# EAGLE design JBC_Station_V3 (EAGLE 7.7.0)
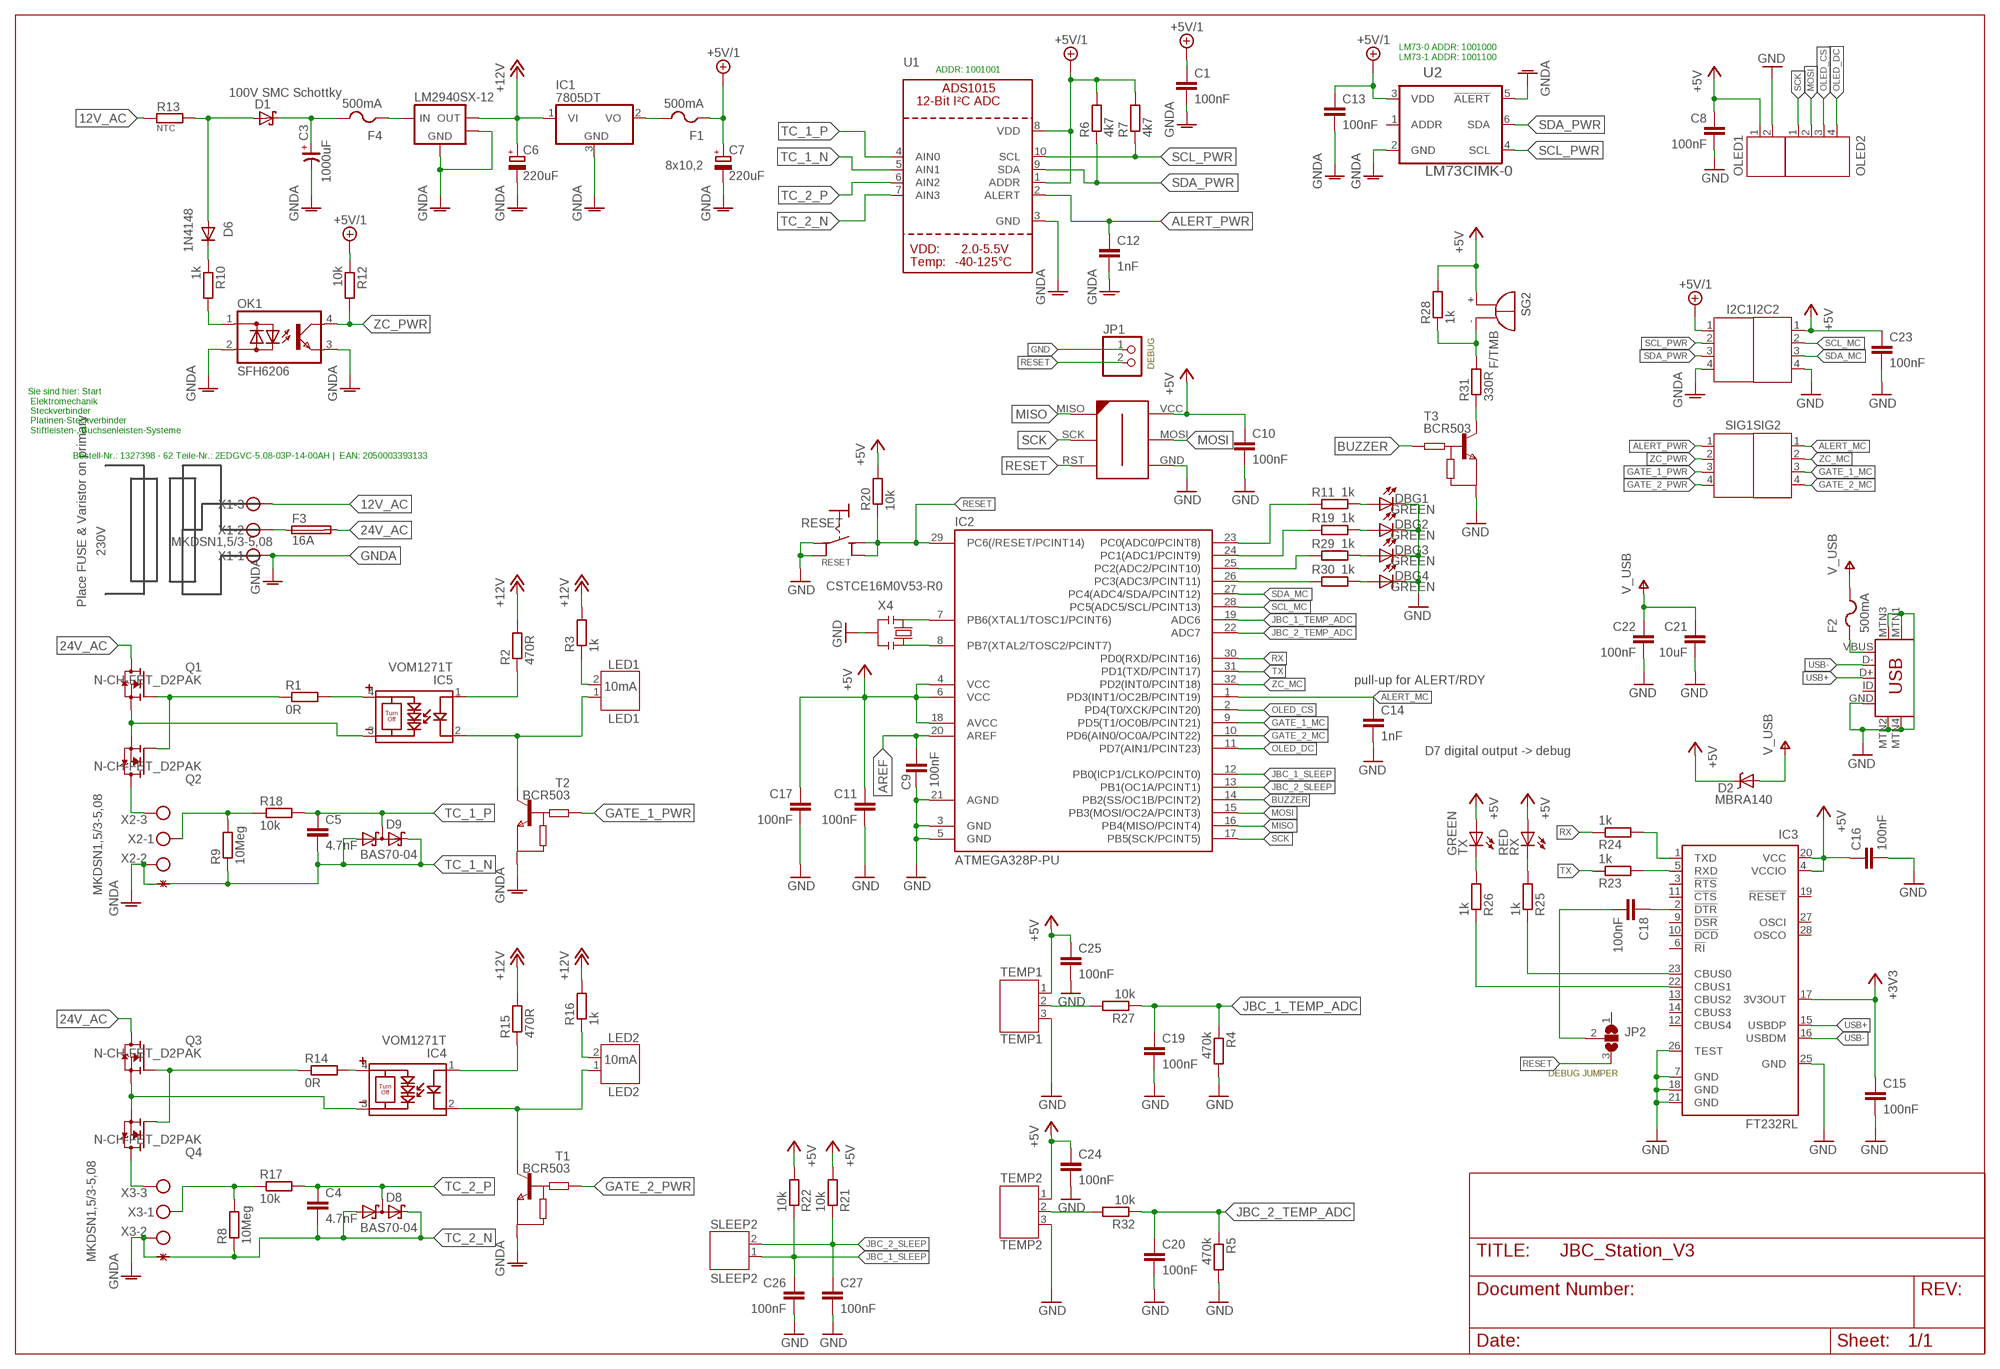
[diagram p0: schematic, sheet 1]

## Parts
C1  100nF  C-EUC0805  [C0805]
C3  1000uF  CP_SV-H  [CSV-H]
C4  4.7nF  C-EUC0805  [C0805]
C5  4.7nF  C-EUC0805  [C0805]
C6  220uF  CPOL-EUE  [PANASONIC_E]
C7  220uF  CPOL-EUE  [PANASONIC_E]
C8  100nF  C-EUC0805  [C0805]
C9  100nF  C-EUC0805  [C0805]
C10  100nF  C-EUC0805  [C0805]
C11  100nF  C-EUC0805  [C0805]
C12  1nF  C-EUC0805  [C0805]
C13  100nF  C-EUC0805  [C0805]
C14  1nF  C-EUC0805  [C0805]
C15  100nF  C-EUC0805  [C0805]
C16  100nF  C-EUC0805  [C0805]
C17  100nF  C-EUC0805  [C0805]
C18  100nF  C-EUC0805  [C0805]
C19  100nF  C-EUC0805  [C0805]
C20  100nF  C-EUC0805  [C0805]
C21  10uF  C-EUC1210  [C1210]
C22  100nF  C-EUC0805  [C0805]
C23  100nF  C-EUC0805  [C0805]
C24  100nF  C-EUC0805  [C0805]
C25  100nF  C-EUC0805  [C0805]
C26  100nF  C-EUC0805  [C0805]
C27  100nF  C-EUC0805  [C0805]
D1  100V SMC Schottky  SCHOTTKY-DIODESMC  [SMC]
D2  MBRA140  DIODE-SCHOTTKY_  [SMA-DIODE]
D6  1N4148  DIODE-MINIMELF  [MINIMELF]
D8  BAS70-04  [SOT23]
D9  BAS70-04  [SOT23]
DBG1  GREEN  LEDCHIP-LED0603  [CHIP-LED0603]
DBG2  GREEN  LEDCHIP-LED0603  [CHIP-LED0603]
DBG3  GREEN  LEDCHIP-LED0603  [CHIP-LED0603]
DBG4  GREEN  LEDCHIP-LED0603  [CHIP-LED0603]
F1  500mA  PTCFUSE-1206  [R1206]
F2  500mA  PTCFUSE-1206  [R1206]
F3  16A  SH25  [SH25]
F4  500mA  PTCFUSE-1206  [R1206]
I2C1  JST-PH4  [JST-PH4]
I2C2  JST-PH4  [JST-PH4]
IC1  7805DT  [TO252]
IC2  ATMEGA328P-PU  MEGA48/88/168-AU  [TQFP32-08]
IC3  FT232RL  [SSOP28]
IC4  VOM1271T  [SOP-4]
IC5  VOM1271T  [SOP-4]
JP1  PINHD-1X2_2.54  [1X02]
JP2  SJ2W  [SJ_2]
LED1  LED1  JST-PH2  [JST-PH2]
LED2  LED2  JST-PH2  [JST-PH2]
LM2940SX-12  LM2940KTT  [TO263-3]
OK1  SFH6206  [DIL4-SMD]
OLED1  JST-PH2  [JST-PH2]
OLED2  JST-PH4  [JST-PH4]
Q1  N-CH-FET_D2PAK  [D2PACK]
Q2  N-CH-FET_D2PAK  [D2PACK]
Q3  N-CH-FET_D2PAK  [D2PACK]
Q4  N-CH-FET_D2PAK  [D2PACK]
R1  0R  R-EU_R0805  [R0805]
R2  470R  R-EU_R0805  [R0805]
R3  1k  R-EU_R0805  [R0805]
R4  470k  R-EU_R0805  [R0805]
R5  470k  R-EU_R0805  [R0805]
R6  4k7  R-EU_R0805  [R0805]
R7  4k7  R-EU_R0805  [R0805]
R8  10Meg  R-EU_R0805  [R0805]
R9  10Meg  R-EU_R0805  [R0805]
R10  1k  R-EU_R0805  [R0805]
R11  1k  R-EU_R0805  [R0805]
R12  10k  R-EU_R0805  [R0805]
R13  NTC  SQMR7  [SQM-VERTICAL-7W]
R14  0R  R-EU_R0805  [R0805]
R15  470R  R-EU_R0805  [R0805]
R16  1k  R-EU_R0805  [R0805]
R17  10k  R-EU_R0805  [R0805]
R18  10k  R-EU_R0805  [R0805]
R19  1k  R-EU_R0805  [R0805]
R20  10k  R-EU_R0805  [R0805]
R21  10k  R-EU_R0805  [R0805]
R22  10k  R-EU_R0805  [R0805]
R23  1k  R-EU_R0805  [R0805]
R24  1k  R-EU_R0805  [R0805]
R25  1k  R-EU_R0805  [R0805]
R26  1k  R-EU_R0805  [R0805]
R27  10k  R-EU_R0805  [R0805]
R28  1k  R-EU_R0805  [R0805]
R29  1k  R-EU_R0805  [R0805]
R30  1k  R-EU_R0805  [R0805]
R31  330R  R-EU_R0805  [R0805]
R32  10k  R-EU_R0805  [R0805]
RESET  RESET  TASTE_DRST_TA1  [TASTE_DRST_TA1]
RX  RED  LEDCHIP-LED0603  [CHIP-LED0603]
SG2  F/TMB  [F/TMB]
SIG1  JST-PH4  [JST-PH4]
SIG2  JST-PH4  [JST-PH4]
SLEEP2  SLEEP2  JST-PH2  [JST-PH2]
T1  BCR503  GM4_BIP_NPN-DIG_SOT23_RZ  [GM4_BIP_SOT23_RZ]
T2  BCR503  GM4_BIP_NPN-DIG_SOT23_RZ  [GM4_BIP_SOT23_RZ]
T3  BCR503  GM4_BIP_NPN-DIG_SOT23_RZ  [GM4_BIP_SOT23_RZ]
TEMP1  TEMP1  JST-PH3  [JST-PH3]
TEMP2  TEMP2  JST-PH3  [JST-PH3]
TX  GREEN  LEDCHIP-LED0603  [CHIP-LED0603]
U1  ADC_ADS1015  [MSOP10]
U2  LM73CIMK-0  [SOT95P285X100-6N]
U$2  STARPONT  [STARPOINT]
U$3  STARPONT  [STARPOINT]
U$5  AVR-ISP-6-EDGE  [6PAD_ISP]
USB  USB-MINIB-5PIN  [USB-MINIB]
X1  MKDSN1,5/3-5,08  [MKDSN1,5/3-5,08]
X2  MKDSN1,5/3-5,08  [MKDSN1,5/3-5,08]
X3  MKDSN1,5/3-5,08  [MKDSN1,5/3-5,08]
X4  CSTCE16M0V53-R0  0011_CSTCE16M0V53-R0  [RESONATOR]

## Nets
12V_AC: R13.P$1 X1.3
12V_AC_PROT: D1.A D6.A R13.P$2
24V_AC: F3.2 Q1.2(D) Q3.2(D)
+3V3: C15.1 IC3.17(3V3OUT)
+5V: C8.1 C10.1 C11.1 C16.1 C17.1 C23.1 C24.1 C25.1 D2.C I2C2.1 IC2.4(VCC) IC2.6(VCC) IC2.18(AVCC) IC3.4(VCCIO) IC3.20(VCC) OLED1.1 R20.2 R21.2 R22.2 R28.2 RX.A SG2.+ TEMP1.1 TEMP2.1 TX.A U$5.VCC
+5V/1: C1.1 C7.+ C13.1 F1.1 I2C1.1 R6.2 R7.2 R12.1 U1.1(ADDR) U1.8(VDD) U2.3(VDD)
+12V: C6.+ IC1.1(VI) LM2940SX-12.3(VOUT) R2.2 R3.2 R15.2 R16.2
ALERT_MC: C14.1 IC2.1(PD3(INT1/OC2B/PCINT19)) SIG2.1
ALERT_PWR: C12.1 SIG1.1 U1.2(ALERT)
AREF: C9.1 IC2.20(AREF)
BUZZER: IC2.14(PB2(SS/OC1B/PCINT2)) T3.1(B)
DBG1: IC2.23(PC0(ADC0/PCINT8)) R11.2
DBG2: IC2.24(PC1(ADC1/PCINT9)) R19.2
DBG3: IC2.25(PC2(ADC2/PCINT10)) R29.2
DBG4: IC2.26(PC3(ADC3/PCINT11)) R30.2
GATE_1_MC: IC2.9(PD5(T1/OC0B/PCINT21)) SIG2.3
GATE_1_PWR: SIG1.3 T2.1(B)
GATE_2_MC: IC2.10(PD6(AIN0/OC0A/PCINT22)) SIG2.4
GATE_2_PWR: SIG1.4 T1.1(B)
GND: C8.2 C9.2 C10.2 C11.2 C14.2 C15.2 C16.2 C17.2 C19.2 C20.2 C21.2 C22.2 C23.2 C24.2 C25.2 C26.2 C27.2 DBG1.C DBG2.C DBG3.C DBG4.C I2C2.4 IC2.3(GND) IC2.5(GND) IC2.21(AGND) IC3.7(GND) IC3.18(GND) IC3.21(GND) IC3.25(GND) IC3.26(TEST) JP1.1 OLED1.2 R4.2 R5.2 RESET.P$1 RESET.P$2 T3.2(E) TEMP1.3 TEMP2.3 U$5.GND USB.GND USB.MTN1(MTN2) USB.MTN2(MTN3) USB.MTN3(MTN1) USB.MTN4 X4.2
GNDA: C1.2 C3.- C6.- C7.- C12.2 C13.2 I2C1.4 IC1.3(GND) LM2940SX-12.2(GND) LM2940SX-12.TAB OK1.2(AC2) OK1.3(E) T1.2(E) T2.2(E) U1.3(GND) U2.2(GND) U2.5(!ALERT!) U$2.P$2 U$3.P$2 X1.1 X2.2 X3.2
JBC_1_SLEEP: C26.1 IC2.12(PB0(ICP1/CLKO/PCINT0)) R22.1 SLEEP2.1
JBC_1_TEMP_ADC: C19.1 IC2.19(ADC6) R4.1 R27.1
JBC_2_SLEEP: C27.1 IC2.13(PB1(OC1A/PCINT1)) R21.1 SLEEP2.2
JBC_2_TEMP_ADC: C20.1 IC2.22(ADC7) R5.1 R32.1
MISO: IC2.16(PB4(MISO/PCINT4)) U$5.MISO
MOSI: IC2.15(PB3(MOSI/OC2A/PCINT3)) OLED2.2 U$5.MOSI
N$1: IC5.4 R1.2
N$2: Q1.1(G) Q2.1(G) R1.1
N$3: LED1.2 R3.1
N$4: IC5.2 LED1.1 T2.3(C)
N$5: IC5.1 R2.1
N$6: IC2.7(PB6(XTAL1/TOSC1/PCINT6)) X4.1
N$7: Q3.1(G) Q4.1(G) R14.1
N$8: Q2.2(D) X2.3
N$9: OK1.1(AC1) R10.2
N$10: Q4.2(D) X3.3
N$11: R9.2 R18.1 X2.1
N$12: C3.+ D1.C F4.2
N$13: R8.2 R17.1 X3.1
N$14: IC5.3 Q1.3(S) Q2.3(S)
N$15: IC4.3 Q3.3(S) Q4.3(S)
N$16: IC4.4 R14.2
N$17: IC4.2 LED2.1 T1.3(C)
N$18: IC4.1 R15.1
N$19: IC2.8(PB7(XTAL2/TOSC2/PCINT7)) X4.3
N$20: LED2.2 R16.1
N$21: F3.1 X1.2
N$23: D6.C R10.1
N$24: C18.2 JP2.2
N$25: C18.1 IC3.2(!DTR)
N$26: F1.2 IC1.2(VO)
N$27: IC3.1(TXD) R24.2
N$28: IC3.5(RXD) R23.2
N$29: IC3.23(CBUS0) R25.1
N$30: IC3.22(CBUS1) R26.1
N$31: R25.2 RX.C
N$32: F2.1 USB.VBUS
N$33: R26.2 TX.C
N$35: R27.2 TEMP1.2
N$37: R28.1 R31.2 SG2.-
N$38: DBG1.A R11.1
N$39: F4.1 LM2940SX-12.1(VIN)
N$40: DBG2.A R19.1
N$41: DBG3.A R29.1
N$42: DBG4.A R30.1
N$46: R31.1 T3.3(C)
N$47: R32.2 TEMP2.2
OLED_CS: IC2.2(PD4(T0/XCK/PCINT20)) OLED2.3
OLED_DC: IC2.11(PD7(AIN1/PCINT23)) OLED2.4
RESET: IC2.29(PC6(/RESET/PCINT14)) JP1.2 JP2.3 R20.1 RESET.P$3 RESET.P$4 U$5.RST
RX: IC2.30(PD0(RXD/PCINT16)) R24.1
SCK: IC2.17(PB5(SCK/PCINT5)) OLED2.1 U$5.SCK
SCL_MC: I2C2.2 IC2.28(PC5(ADC5/SCL/PCINT13))
SCL_PWR: I2C1.2 R7.1 U1.10(SCL) U2.4(SCL)
SDA_MC: I2C2.3 IC2.27(PC4(ADC4/SDA/PCINT12))
SDA_PWR: I2C1.3 R6.1 U1.9(SDA) U2.6(SDA)
TC_1_N: C5.2 D9.1(A1) D9.2(C2) R9.1 U1.5(AIN1) U$2.P$1
TC_1_P: C5.1 D9.3(C1A2) R18.2 U1.4(AIN0)
TC_2_N: C4.2 D8.1(A1) D8.2(C2) R8.1 U1.7(AIN3) U$3.P$1
TC_2_P: C4.1 D8.3(C1A2) R17.2 U1.6(AIN2)
TX: IC2.31(PD1(TXD/PCINT17)) R23.1
USB+: IC3.15(USBDP) USB.D+
USB-: IC3.16(USBDM) USB.D-
V+: C21.1 C22.1 D2.A F2.2 ; supply symbol labelled V_USB
ZC_MC: IC2.32(PD2(INT0/PCINT18)) SIG2.2
ZC_PWR: OK1.4(C) R12.2 SIG1.2
Unconnected: IC3.3(!RTS) IC3.6(!RI) IC3.9(!DSR) IC3.10(!DCD) IC3.11(!CTS) IC3.12(CBUS4) IC3.13(CBUS2) IC3.14(CBUS3) IC3.19(!RESET) IC3.27(OSCI) IC3.28(OSCO) JP2.1 U2.1(ADDR) USB.ID

## Notes on the sheet
- LM73-0 ADDR: 1001000
  LM73-1 ADDR: 1001100
- ADDR: 1001001
- 8x10,2
- DEBUG
- Sie sind hier: Start 
   Elektromechanik 
   Steckverbinder 
   Platinen-Steckverbinder 
   Stiftleisten-, Buchsenleisten-Systeme
- Bestell-Nr.: 1327398 - 62 Teile-Nr.: 2EDGVC-5.08-03P-14-00AH |  EAN: 2050003393133
- 230V
- Place FUSE & Varistor on primary
- pull-up for ALERT/RDY
- 10mA
- D7 digital output -> debug
- 10mA
- DEBUG JUMPER

## Library data of the parts
C1 C4 C5 C8-C27 = rcl:C-EU: CAPACITOR, European symbol
C3 = rc-master-smd:CP_: POLARIZED CAP
C6 C7 = rcl:CPOL-EU: POLARIZED CAPACITOR, European symbol
D1 = diode:SCHOTTKY-DIODE: Schottky Diode
D2 = SparkFun:DIODE-SCHOTTKY
D6 = diode:DIODE-: DIODE
D8 D9 = diode:BAS70-04: Silicon Schottky Diodes General-purpose diode for high-speed switching
DBG1-DBG4 RX TX = led:LED: LED OSRAM: - CHIPLED LG R971, LG N971, LY N971, LG Q971, LY Q971, LO R971, LY R971 LH N974, LH R974 LS Q976, LO Q976, LY Q976 LO Q996 - Hyper CHIPLED LW Q18S LB Q993, LB Q99A, LB R99A - SideLED LS A670, LO A670, LY A670, LG A670, LP A670 LB A673, LV A673, LT A673, LW A673 LH A674 LY A675 LS A676, LA A676, LO A676, LY A676, LW A676 LS A679, LY A679, LG A679 - Hyper Micro SIDELED® LS Y876, LA Y876, LO Y876, LY Y876 LT Y87S - SmartLED LW L88C, LW L88S LB L89C, LB L89S, LG L890 LS L89K, LO L89K, LY L89K LS L896, LA L896, LO L896, LY L896 - TOPLED LS T670, LO T670, LY T670, LG T670, LP T670 LSG T670, LSP T670, LSY T670, LOP T670, LYG T670 LG T671, LOG T671, LSG T671 LB T673, LV T673, LT T673, LW T673 LH T674 LS T676, LA T676, LO T676, LY T676, LB T676, LH T676, LSB T676, LW T676 LB T67C, LV T67C, LT T67C, LS T67K, LO T67K, LY T67K, LW E67C LS E67B, LA E67B, LO E67B, LY E67B, LB E67C, LV E67C, LT E67C LW T67C LS T679, LY T679, LG T679 LS T770, LO T770, LY T770, LG T770, LP T770 LB T773, LV T773, LT T773, LW T773 LH T774 LS E675, LA E675, LY E675, LS T675 LS T776, LA T776, LO T776, LY T776, LB T776 LHGB T686 LT T68C, LB T68C - Hyper Mini TOPLED® LB M676 - Mini TOPLED Santana® LG M470 LS M47K, LO M47K, LY M47K Source: http://www.osram.convergy.de LUXEON: - LUMILED® LXK2-PW12-R00, LXK2-PW12-S00, LXK2-PW14-U00, LXK2-PW14-V00 LXK2-PM12-R00, LXK2-PM12-S00, LXK2-PM14-U00 LXK2-PE12-Q00, LXK2-PE12-R00, LXK2-PE12-S00, LXK2-PE14-T00, LXK2-PE14-U00 LXK2-PB12-K00, LXK2-PB12-L00, LXK2-PB12-M00, LXK2-PB14-N00, LXK2-PB14-P00, LXK2-PB14-Q00 LXK2-PR12-L00, LXK2-PR12-M00, LXK2-PR14-Q00, LXK2-PR14-R00 LXK2-PD12-Q00, LXK2-PD12-R00, LXK2-PD12-S00 LXK2-PH12-R00, LXK2-PH12-S00 LXK2-PL12-P00, LXK2-PL12-Q00, LXK2-PL12-R00 Source: www.luxeon.com KINGBRIGHT: KA-3528ASYC Source: www.kingbright.com
F1 F2 F4 = adafruit:PTCFUSE: PTC fuses, resettable thermistors
F3 = fuse:SH25: FUSE HOLDER grid 25 mm, OGN0031 8211, Schurter (Buerklin); MF: SCHURTER; MPN: 0031.8211; OC_FARNELL: 1162741; OC_NEWARK: 96B9380
I2C1 I2C2 OLED2 SIG1 SIG2 = jst-ph:JST-PH4
IC1 = linear:78*: Positive VOLTAGE REGULATOR Source: http://cache.national.com/ds/LM/LM78L05.pdf http://www.fairchildsemi.com/ds/LM/LM7805.pdf
IC2 = avr-6:MEGA48/88/168
IC3 = ftdichip:FT232R: Source: http://www.ftdichip.com/Documents/DataSheets/DS_FT232R_v104.pdf; MPN: FT232RL; OC_FARNELL: 1146032; OC_NEWARK: 91K9918
IC4 IC5 = eigene_lib:VOM1271T
JP1 = pinhead_SMD:PINHD-1X2: PIN HEADER
JP2 = jumper:SJ2W: SMD solder JUMPER
LED1 LED2 OLED1 SLEEP2 = jst-ph:JST-PH2
LM2940SX-12 = bt_regulator:LM2940: LM2940 LDO Voltage Regulator Input Voltage Range = 6 V to 26 V Dropout Voltage Typically 0.5 V at IOUT = 1 A Reverse Battery Protection Internal Short Circuit Current Limit electrostatic discharge protection (±2kV) Tab is GND The LM2940-N/LM2940C positive voltage regulator features the ability to source 1A of output current with a dropout voltage of typically 0.5V and a maximum of 1V over the entire temperature range. Furthermore, a quiescent current reduction circuit has been included which reduces the ground current when the differential between the input voltage and the output exceeds approximately 3V. Designed also for vehicular applications, the LM2940-N/LM2940C and all regulated circuitry are protected from reverse battery installations or 2-battery jumps. During line transients, such as load dump when the input voltage can momentarily exceed the specified maximum operating voltage, the regulator will automatically shut down to protect both the internal circuits and the load. The LM2940/LM2940C cannot be harmed by temporary mirror-image insertion. Familiar regulator features such as short circuit and thermal overload protection are also provided. Datasheet.pdf <http://www.ti.com/lit/ds/symlink/lm2940-n.pdf>
OK1 = optocoupler:SFH620: Optocoupler, Phototransistor Output, AC Input Source: http://www.vishay.com/docs/83675/sfh620.pdf; MF: VISHAY/TELEFUNKEN; MPN: SFH6206-3; OC_FARNELL: 1469585; OC_NEWARK: 58K2214
Q1-Q4 = 1_eigene_lib:N-CH-FET: Cool MOS Power Transistor
R1-R12 R14-R32 = rcl:R-EU_: RESISTOR, European symbol
R13 = Phil_lib_6.5_Conti_02:SQMR7
RESET = Phil VCX60 2012_Apr:TASTE_DRST_TA1
SG2 = buzzer:F/TMB: BUZZER Source: Buerklin; OC_FARNELL: unknown; OC_NEWARK: unknown
T1-T3 = PFC_Power_v4:GM4_BIP_NPN-DIG: NPN Digitaltransistor wie BCR148
TEMP1 TEMP2 = jst-ph:JST-PH3
U1 = microbuilder2:ADC_ADS1015: ADS1015 - 12-bit 4-Channel I2C ADC with Internal PGA VDD: 2.0-5.5V Sampling Rate: 3.3ksps Gain Settings: 2/3, 1, 2, 4, 8, 16 I2C Address: ADDR low = 1001000x, ADDR high = 1001001x Internal Comparator The ADS1015 includes an internal comparator that can be set to output a high-level on ALERT when the conversion results exceeeds a pre-defined upper level, and will deassert itself when the level falls below a pre-defined lower threshold level. It can also be set to windowed mode where the ALERT pin will be asserted if the data exceeds the upper threshold or falls below the lower threshold.
U2 = LM73:LM73CIMK-0: Digital Temperature Sensor; MPN: LM73CIMK-0; OC_FARNELL: 1312598; OC_NEWARK: 69K2606; PACKAGE: SOT-23-6; SUPPLIER: National Semiconductor
U$2 U$3 = eigene_lib:STARPONT
U$5 = avr-6:AVR-ISP-6-EDGE: 6 pin edge connector for ISP with ATMEL MCUs. Developed by Craig Moates (craig at moates dot net). Library by David Blundell (blundar at gmail dot com). Often, even a 6 pin header is really inconvenient for board layout and/or production. This SMD-only header is our de-facto standard for using an edge connector for programming with the help of a 6pin/10pin to edge card adapter.
USB = SparkFun:USB-MINIB: Mini-USB "B" connector with 5th pin broken out. Created new symbol breaking out 5th "ID" pin in mini/micro USB connector spec. See: http://en.wikipedia.org/wiki/Mini_usb#Cables. Uses same footprint as 4-pin symbol. Also added pins to connect to mounting / shield pads if required (probably not generally needed as signals aren't shielded once they leave the connector).
X1-X3 = con-phoenix-508:MKDSN1,5/3-5,08: MKDSN 1,5/ 3-5,08 Printklemme Nennstrom: 13,5 A Nennspannung: 250 V Rastermaß: 5,08 mm Polzahl: 3 Anschlussart: Schraubanschluss Montage: Löten Anschlussrichtung Leiter/Platine: 0 ° Artikelnummer: 1729131 Source: http://eshop.phoenixcontact.com .. 1729131.pdf
X4 = NanoV3.2:0011_CSTCE16M0V53-R0: 16Mhz - SMD; MONTHLY_USAGE: _____; PART_NUMBER: CSTCE16M0V53-R0; PRICE: _____; SUPPLIER: _____; TYPE: Cristalli

## Board
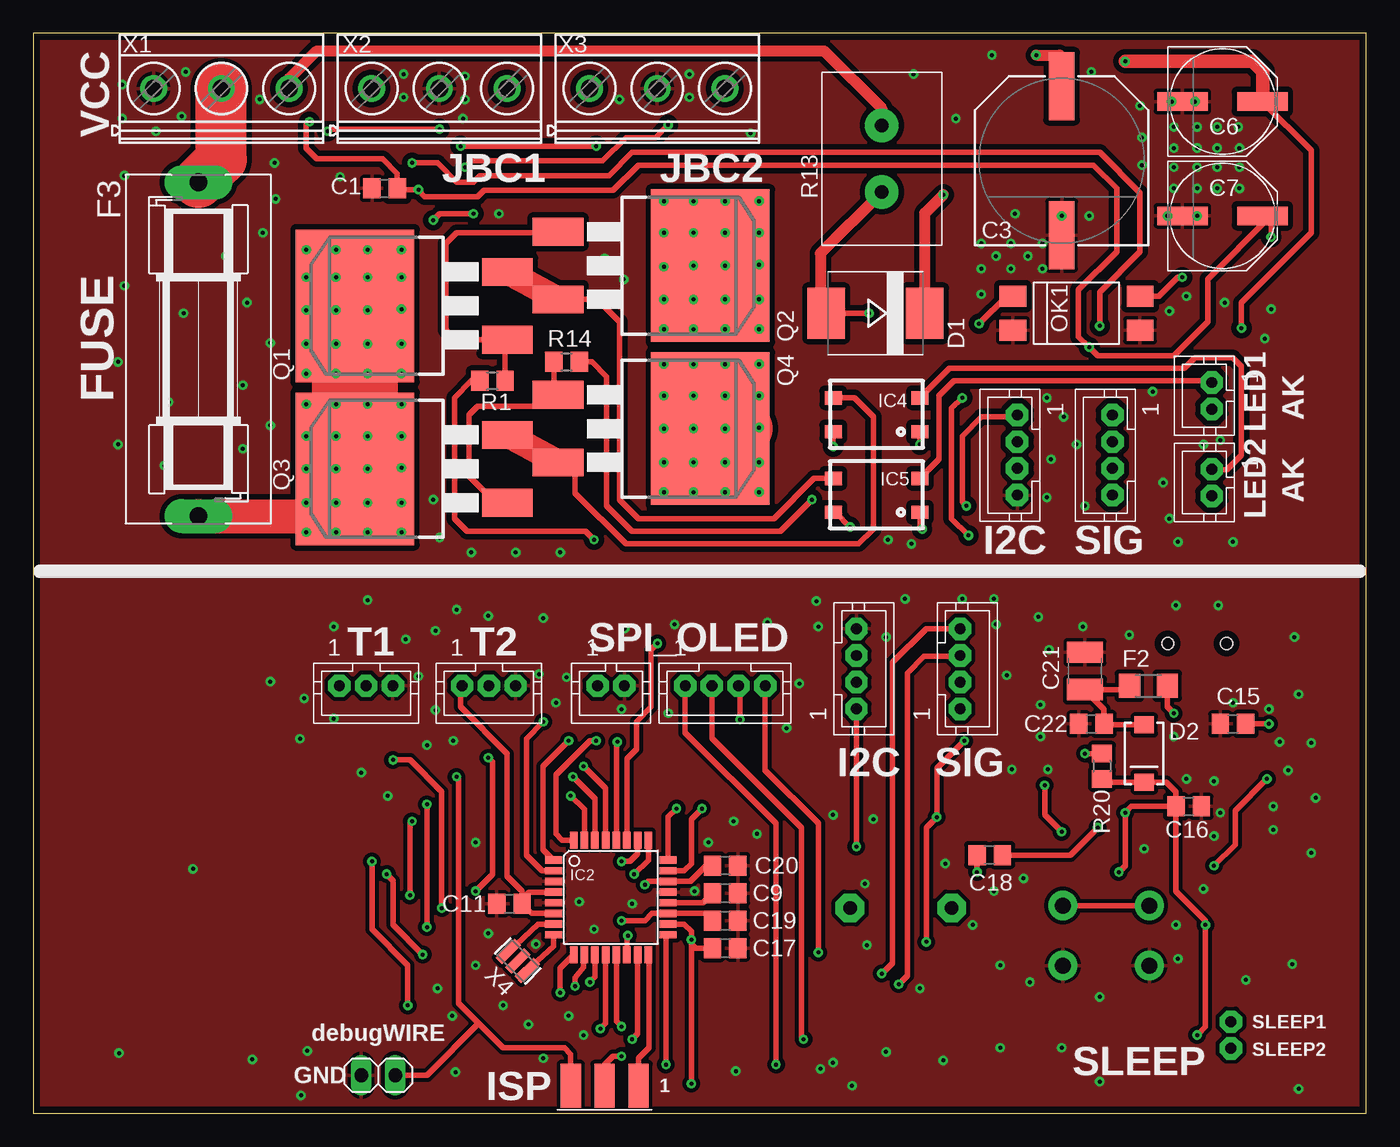
[diagram p1: board, top side]
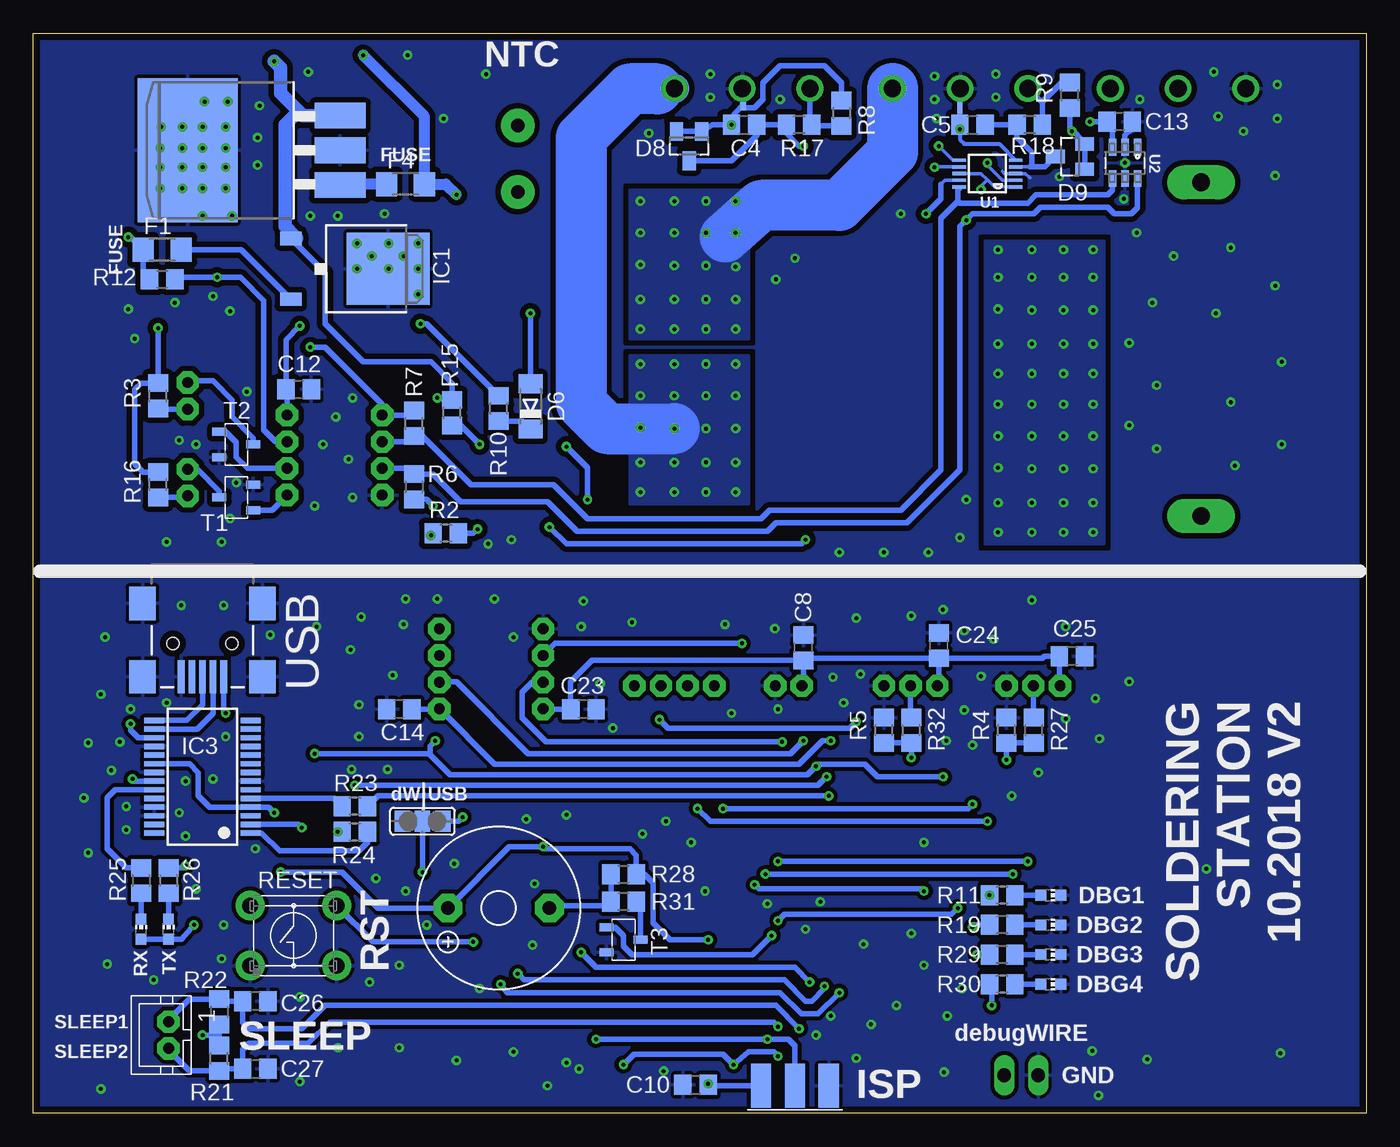
[diagram p2: board, bottom side, seen from below]

Size 100 x 81 mm. Coordinates in mm from the lower left corner, seen from the top.
Outline: 0,0 100,0 100,81 0,81 0,0
Copper layers (1*16): Top 0.035mm / dielectric 1.6mm / Bottom 0.035mm
Design rules "Elecrow_2-layer_PCB_eagle_rule": minimum track width 6mil, minimum drill 0.3mm, track to track 6mil, track to pad 8mil, pad to pad 12mil, via to via 12mil, smd to smd 0mil, copper to edge 20mil, drill to drill 10mil, minimum pad ring 6mil, minimum via ring 6mil, stop-mask expansion 0mil, vias tented up to drill 100mil, thermal gap 10mil

### Footprints (pad centres in the part's own frame; a part is rotated, then mirrored left to right if it is on the bottom)
C0805 = smd 1.3 x 1.5: 1 -0.95,0; 2 0.95,0
CSV-H = smd 5.08 x 1.93: + -5.588,0; - 5.588,0
PANASONIC_E = smd 3.8 x 1.4: + 3,0; - -3,0
C1210 = smd 1.6 x 2.7: 1 -1.4,0; 2 1.4,0
SMC = smd 2.8 x 3.8: A 3.7,0; C -3.7,0
SMA-DIODE = smd 1.27 x 1.47: A -2.15,0; C 2.15,0
MINIMELF = smd 1.4 x 1.8: A 1.7,0; C -1.7,0
SOT23 = smd 1 x 1.4: 1 -0.95,-1.1; 2 0.95,-1.1; 3 0,1.1
CHIP-LED0603 = smd 0.8 x 0.8: A 0,-0.75; C 0,0.75
R1206 = smd 1.6 x 1.803: 1 -1.422,0; 2 1.422,0
SH25 = drill 1.321 pad 2.54 long: 1 -12.522,0; 2 12.522,0
JST-PH4 = drill 0.813 pad 1.676 octagon: 1 3,0; 2 1,0; 3 -1,0; 4 -3,0
TO252 = smd 1 x 1.6: 1 -2.28,-4.8; 2 2.28,-4.8 | smd 5.4 x 6.2: 3 0,2.5
TQFP32-08 = smd 1.27 x 0.559: 1 -4.293,2.8; 2 -4.293,2; 3 -4.293,1.2; 4 -4.293,0.4; 5 -4.293,-0.4; 6 -4.293,-1.2; 7 -4.293,-2; 8 -4.293,-2.8; 17 4.293,-2.8; 18 4.293,-2; 19 4.293,-1.2; 20 4.293,-0.4; 21 4.293,0.4; 22 4.293,1.2; 23 4.293,2; 24 4.293,2.8 | smd 0.559 x 1.27: 9 -2.8,-4.293; 10 -2,-4.293; 11 -1.2,-4.293; 12 -0.4,-4.293; 13 0.4,-4.293; 14 1.2,-4.293; 15 2,-4.293; 16 2.8,-4.293; 25 2.8,4.293; 26 2,4.293; 27 1.2,4.293; 28 0.4,4.293; 29 -0.4,4.293; 30 -1.2,4.293; 31 -2,4.293; 32 -2.8,4.293
SSOP28 = smd 0.4 x 1.5: 1 -4.225,-3.625; 2 -3.575,-3.625; 3 -2.925,-3.625; 4 -2.275,-3.625; 5 -1.625,-3.625; 6 -0.975,-3.625; 7 -0.325,-3.625; 8 0.325,-3.625; 9 0.975,-3.625; 10 1.625,-3.625; 11 2.275,-3.625; 12 2.925,-3.625; 13 3.575,-3.625; 14 4.225,-3.625; 15 4.225,3.625; 16 3.575,3.625; 17 2.925,3.625; 18 2.275,3.625; 19 1.625,3.625; 20 0.975,3.625; 21 0.325,3.625; 22 -0.325,3.625; 23 -0.975,3.625; 24 -1.625,3.625; 25 -2.275,3.625; 26 -2.925,3.625; 27 -3.575,3.625; 28 -4.225,3.625
SOP-4 = smd 1.27 x 1: 1 -3.175,1.27; 2 -3.175,-1.27; 3 3.325,-1.27; 4 3.325,1.27
1X02 = drill 1.016 long: 1 -1.27,0; 2 1.27,0
SJ_2 = smd 1.168 x 1.6: 1 -1.524,0; 2 0,0; 3 1.524,0
JST-PH2 = drill 0.813 pad 1.676 octagon: 1 1,0; 2 -1,0
TO263-3 = smd 1.93 x 3.81: 1 -2.611,-7.624; 2 -0.007,-7.626; 3 2.597,-7.628 | smd 10.795 x 7.493: TAB 0,3.81
DIL4-SMD = smd 1.6 x 2: 1 -1.27,-4.77; 2 1.27,-4.77; 3 1.27,4.77; 4 -1.27,4.77
D2PACK = smd 2.083 x 3.81: 1 -2.54,-8.89; 3 2.54,-8.89 | smd 11.43 x 8.89: 2 0,2.54
R0805 = smd 1.3 x 1.5: 1 -0.95,0; 2 0.95,0
SQM-VERTICAL-7W = drill 1 pad 2.5: P$1 2.5,0; P$2 -2.5,0
TASTE_DRST_TA1 = drill 1.2 pad 2.184: P$1 -2.25,3.25; P$2 -2.25,-3.25; P$3 2.25,-3.25; P$4 2.25,3.25
F/TMB = drill 1.016 pad 2.159 octagon: + 3.81,0; - -3.81,0
GM4_BIP_SOT23_RZ = smd 0.6 x 1.05: 1 -0.953,-1.27; 2 0.953,-1.27; 3 0,1.27
JST-PH3 = drill 0.813 pad 1.676 octagon: 1 1.005,0; 2 -1,0; 3 -3,0
MSOP10 = smd 0.25 x 1: 1 -1,-2.113; 2 -0.5,-2.113; 3 0,-2.113; 4 0.5,-2.113; 5 1,-2.113; 6 1,2.113; 7 0.5,2.113; 8 0,2.113; 9 -0.5,2.113; 10 -1,2.113
SOT95P285X100-6N = smd 1.27 x 0.559: 1 -1.168,0.94; 2 -1.168,0; 3 -1.168,-0.94; 4 1.168,-0.94; 5 1.168,0; 6 1.168,0.94
STARPOINT = smd 0.813 x 0.406: P$1 -0.159,0; P$2 0.159,0
6PAD_ISP = smd 1.524 x 3.302 bottom: GND 2.54,0; MOSI 0,0; VCC -2.54,0 | smd 1.524 x 3.302: MISO -2.54,0; RST 2.54,0; SCK 0,0
USB-MINIB = smd 2.5 x 0.5: D+ 2.5,0; D- 2.5,0.8; GND 2.5,-1.6; ID 2.5,-0.8; VBUS 2.5,1.6 | smd 2.5 x 2: MTN1 -3,4.5; MTN2 2.5,4.5; MTN3 -3,-4.5; MTN4 2.5,-4.5 | hole 0.9: 0,2.2; 0,-2.2
MKDSN1,5/3-5,08 = drill 1.3 pad 2: 1 -7.641,0.025; 2 -2.561,0.025; 3 2.519,0.025
RESONATOR = smd 0.7 x 2: 1 -1,0; 2 0,0; 3 1,0

### Placement (x,y rotation side)
C1  26.35,69.37 180 top
C3  77.15,71.44 270 top
C4  46.67,74.14 180 bottom
C5  29.53,74.14 180 bottom
C6  89.22,75.88 0 top
C7  89.22,67.31 0 top
C8  42.23,34.92 90 bottom
C9  51.91,16.51 0 top
C10  50.32,2.14 180 bottom
C11  35.72,15.72 180 top
C12  80.09,54.29 0 bottom
C13  18.49,74.37 0 bottom
C14  72.55,30.32 180 bottom
C15  90.01,29.21 180 top
C16  86.68,23.02 0 top
C17  51.91,12.38 0 top
C18  71.75,19.37 180 top
C19  51.91,14.45 0 top
C20  51.91,18.57 0 top
C21  78.9,33.18 90 top
C22  79.38,29.21 180 top
C23  58.74,30.32 0 bottom
C24  32.07,35.08 90 bottom
C25  22.07,34.29 0 bottom
C26  83.34,8.41 0 bottom
C27  83.34,3.33 0 bottom
D1  63.18,60.01 180 top
D2  83.34,26.99 270 top
D6  62.71,53.02 90 bottom
D8  50.8,72.55 180 bottom
D9  22.23,71.75 90 bottom
DBG1  23.65,16.35 270 bottom
DBG2  23.65,14.13 270 bottom
DBG3  23.65,11.91 270 bottom
DBG4  23.65,9.68 270 bottom
F1  90.33,64.77 0 bottom
F2  83.66,32.07 180 top
F3  12.38,57.31 270 top
F4  72.07,69.69 0 bottom
I2C1  73.82,49.37 90 top
I2C2  61.75,33.34 270 top
IC1  75.88,63.34 270 bottom
IC2  43.34,16.19 0 top
IC3  87.31,25.24 90 bottom
IC4  63.34,52.39 180 top
IC5  63.34,46.35 180 top
JP1  25.88,2.86 0 top
JP2  70.8,21.91 0 bottom
LED1  88.42,53.82 90 top
LED2  88.42,47.31 90 top
LM2940SX-12  84.61,72.23 90 bottom
OK1  78.26,60.01 270 top
OLED1  43.34,32.07 180 top
OLED2  51.91,32.07 180 top
Q1  26.67,60.56 90 top
Q2  48.26,63.58 270 top
Q3  26.67,48.34 90 top
Q4  48.26,51.36 270 top
R1  34.45,54.93 180 top
R2  69.06,43.5 180 bottom
R3  90.65,53.82 90 bottom
R4  26.99,28.73 90 bottom
R5  36.2,28.73 90 bottom
R6  71.44,46.99 270 bottom
R7  71.44,51.75 90 bottom
R8  39.37,75.01 270 bottom
R9  22.23,76.36 90 bottom
R10  65.09,52.86 90 bottom
R11  27.3,16.35 180 bottom
R12  90.33,62.55 0 bottom
R13  63.66,71.6 90 top
R14  40.01,56.36 0 top
R15  68.58,52.55 90 bottom
R16  90.65,47.15 90 bottom
R17  42.55,74.14 180 bottom
R18  25.24,74.14 180 bottom
R19  27.3,14.13 180 bottom
R20  80.17,26.04 270 top
R21  86.04,4.13 90 bottom
R22  86.04,7.62 270 bottom
R23  75.88,23.02 180 bottom
R24  75.88,21.11 0 bottom
R25  91.92,17.46 270 bottom
R26  89.85,17.46 270 bottom
R27  24.92,28.73 90 bottom
R28  55.72,17.94 0 bottom
R29  27.3,11.91 180 bottom
R30  27.3,9.68 180 bottom
R31  55.72,15.88 180 bottom
R32  34.13,28.73 90 bottom
RESET  80.49,13.34 90 bottom
RX  91.92,13.81 0 bottom
SG2  65.09,15.4 180 bottom
SIG1  80.96,49.37 90 top
SIG2  69.53,33.34 270 top
SLEEP2  89.85,5.87 90 bottom
T1  84.77,46.2 90 bottom
T2  84.77,50.16 270 bottom
T3  55.72,13.02 270 bottom
TEMP1  23.97,32.07 180 top
TEMP2  33.18,32.07 180 top
TX  89.85,13.81 0 bottom
U1  28.42,70.48 90 bottom
U2  18.1,71.28 270 bottom
U$2  30.48,75.56 90 bottom
U$3  46.75,75.8 90 bottom
U$5  42.86,2.06 180 top
USB  87.31,35.24 270 bottom
X1  16.67,76.83 0 top
X2  33.02,76.83 0 top
X3  49.37,76.83 0 top
X4  36.35,11.43 315 top

### Tracks (layer width: path | path; a pad name or v marks a point on that pad's centre or on a via)
12V_AC
  Top 0.813: X1.3 19.19,77.61 21.27,79.69 59.33,79.69 63.66,75.37 R13.P$1
12V_AC_PROT  (via drill 0.3 pad 0.7)
  Top 0.406: D1.A v62.71,60.01
  Top 0.813: R13.P$2 59.05,64.49 59.05,60.33 59.37,60.01 D1.A
  Bottom 0.406: v62.71,60.01 D6.A
24V_AC  (via drill 0.3 pad 0.7)
  Top 0.406: Q3.2 23.26,48.34 24.45,48.1 24.45,47.94 25.4,47.15 | 23.97,60.17 24.13,59.85 Q1.2 24.77,60.56 v25.08,60.25 | 22.29,44.79 22.48,45.58 v22.7,45.8
  Top 2.54: F3.2 22.29,44.79 Q3.2
  Top 3.81: 23.43,45.1 Q3.2
  Top 6.452: Q3.2 Q1.2
  other vias: 20.48,53.18 22.7,53.18 25.08,53.18 27.62,53.18 22.7,50.8 25.08,50.8 27.62,50.8 20.48,50.8 20.48,48.34 22.7,48.34 25.08,48.34 27.62,48.42 20.48,45.8 20.48,43.58 22.7,43.58 25.08,43.58 27.62,43.58 25.08,45.8 27.62,45.8 20.48,64.77 22.7,64.77 25.08,64.77 27.62,64.77 22.7,62.71 25.08,62.71 27.62,62.71 20.48,62.71 20.48,60.25 22.7,60.25 27.62,60.33 20.48,57.71 20.48,55.48 22.7,55.48 25.08,55.48 27.62,55.48 22.7,57.71 25.08,57.71 27.62,57.71
  pour Bottom: 28.57,54.45 19.68,54.45 19.68,42.7 28.57,42.7
  pour Bottom: 28.57,65.41 19.68,65.41 19.68,54.45 28.57,54.45
+3V3  (via drill 0.3 pad 0.7)
  Top 0.406: v92.71,29.21 C15.1
  Bottom 0.406: IC3.17 92.14,28.17 92.71,28.73 v92.71,29.21
+5V  (via drill 0.3 pad 0.7)
  Top 0.406: C16.1 82.39,23.02 v81.92,22.54 81.92,18.57 v81.44,18.1 | C16.1 85.72,24.13 85.02,24.84 D2.C 80.42,24.84 R20.2 | v61.75,20 I2C2.1 61.73,30.32 | C16.1 85.73,16.67 87.95,14.45 v87.95,14.13 87.95,6.51 v87.31,5.87 | IC2.6 37.37,14.99 36.67,15.69 C11.1 | IC2.4 37.2,16.59 36.67,16.06 C11.1 | IC2.18 48.83,14.19 49.37,13.65 v49.37,13.02 | v49.37,13.02 49.37,12.7 49.69,12.38 C17.1 | TEMP2.1 32.07,31.96 32.07,30.48 35.56,26.99 35.56,17.78 36.67,16.67 C11.1 | v49.37,13.02 v49.37,2.22
  Bottom 0.406: v81.92,22.54 82.34,22.97 IC3.4 86.78,22.97 87.63,23.81 87.63,25.56 88.29,26.22 IC3.20 | R21.2 86.04,5.87 | TEMP1.1 23.02,32.12 C25.1 24.13,34.29 24.29,34.13 C24.1 | I2C2.1 61.75,30.32 C23.1 59.69,32.39 58.1,33.98 C8.1 | R22.2 86.04,5.87 | 86.04,5.87 v87.31,5.87 | C24.1 42.07,34.13 C8.1 | C24.1 32.07,32.17 TEMP2.1 | RX.A TX.A 88.86,13.06 v87.95,14.13 | U$5.VCC 48.1,2.06 48.42,2.07 49.14,2.07 C10.1 49.37,2.07 v49.37,2.22 | C8.1 42.23,32.18 OLED1.1 | v49.37,13.02 52.23,13.02 53.5,14.29 53.5,17.3 54.13,17.94 R28.2 54.77,19.37 55.24,19.84 61.75,19.84 v61.75,20 64.29,20 SG2.+ 74.14,15.4 76.83,18.1 v81.44,18.1
+5V/1  (via drill 0.3 pad 0.7)
  Top 0.406: v70.01,45.56 69.69,45.88 69.69,50.8 71.12,52.23 73.68,52.23 I2C1.1 | v20.72,74.37 20.48,74.14 20.48,72.39 21.27,71.6 26.19,71.6 27.3,70.49 C1.1 27.4,69.28 v28.89,69.28 28.89,69.22 29.37,68.74 33.34,68.74 33.81,69.22 43.5,69.22 45.4,71.12 79.53,71.12 81.28,69.37 81.28,64.61 78.42,61.75 78.42,58.26 v79.22,57.47 79.85,56.83 85.57,56.83 88.11,59.37 88.11,62.55 92.71,67.15 | v92.87,65.72 92.87,66.66 92.23,67.29 92.57,67.29 92.71,67.15 | 92.71,67.15 92.87,67.31
  Top 1.016: 92.23,67.29 C7.+
  Bottom 0.254: 28.42,70.01 27.89,69.48 U1.1 27.3,69.48 | 28.42,70.01 28.89,70.48 U1.8 | 28.42,70.01 28.89,69.53 v28.89,69.28
  Bottom 0.406: C13.1 19.36,74.46 | R7.2 71.93,52.37 I2C1.1 73.82,53.18 78.11,57.47 v79.22,57.47 | R6.2 70.49,46.04 v70.01,45.56 | 19.13,74.69 C13.1 | 18.97,72.52 U2.3 19.04,74.13 C13.1 | v20.72,74.37 C13.1 | R12.1 91.75,63.02 F1.1 92.7,65.72 v92.87,65.72
+12V  (via drill 0.3 pad 0.7)
  Top 0.406: v90.65,58.9 90.65,60.8 95.89,66.04 95.89,72.22 C6.+ | v69.69,53.66 68.9,52.86 68.9,44.61 v70.17,43.34
  Top 1.016: v81.92,78.9 91.44,78.9 92.23,78.11 92.23,75.9 C6.+
  Bottom 0.406: R16.2 91.75,48.1 92.39,48.74 92.39,54.29 91.92,54.77 R3.2 v90.65,58.9 | v69.69,53.66 69.05,53.5 R15.2 68.58,54.77 70.17,56.36 75.25,56.36 78.11,59.21 78.11,63.04 IC1.1 | v70.17,43.34 R2.2
  Bottom 1.016: LM2940SX-12.3 79.75,74.83 80.09,75.17 | 80.09,75.17 81.44,76.52 81.44,78.42 v81.92,78.9 | IC1.1 80.23,65.62 81.12,66.52 81.12,74.14 80.09,75.17
ALERT_MC  (via drill 0.3 pad 0.7)
  Top 0.406: IC2.1 38.26,19.78 38.26,26.04 v40.16,27.94
  Bottom 0.406: C14.1 69.53,30.32 SIG2.1 65.39,26.19 42.55,26.19 40.8,27.94 v40.16,27.94
ALERT_PWR  (via drill 0.3 pad 0.7)
  Top 0.406: v28.42,71.28 30.32,71.28 31.75,69.85 33.02,69.85 33.5,70.33 43.18,70.33 44.93,72.07 80.01,72.07 83.03,69.06 83.03,64.61 80.01,61.59 v80.01,59.05
  Bottom 0.254: U1.2 27.28,69.98 28.42,71.12 v28.42,71.28
  Bottom 0.406: SIG1.1 80.96,54.22 C12.1 81.04,58.03 v80.01,59.05
AREF
  Top 0.406: IC2.20 50.24,15.79 C9.1
BUZZER  (via drill 0.3 pad 0.7)
  Top 0.406: IC2.14 44.54,13.27 v44.61,13.34
  Bottom 0.406: T3.1 56.36,13.97 55.72,13.34 55.72,12.54 55.09,11.91 46.04,11.91 v44.61,13.34
DBG1  (via drill 0.3 pad 0.7)
  Top 0.406: IC2.23 48.83,18.19 49.37,18.73 49.37,22.07 v50.16,22.86 | v28.26,16.35 28.26,21.75 v28.42,21.91
  Bottom 0.406: 28.57,16.35 v28.26,16.35 R11.2 | v50.16,22.86 49.21,21.91 v28.42,21.91
DBG2  (via drill 0.3 pad 0.7)
  Top 0.406: v29.53,23.18 v29.53,13.97 | IC2.24 47.63,22.23 v48.26,22.86
  Bottom 0.406: v29.53,13.97 29.37,14.13 R19.2 | v48.26,22.86 29.84,22.86 v29.53,23.18
DBG3  (via drill 0.3 pad 0.7)
  Top 0.406: IC2.25 46.14,18.99 v45.09,17.94 | v26.51,17.94 26.99,17.46 26.99,14.13 v29.21,11.91
  Bottom 0.406: v45.09,17.94 v26.51,17.94 | v29.21,11.91 R29.2
DBG4  (via drill 0.3 pad 0.7)
  Top 0.406: IC2.26 45.34,19.46 44.77,18.89 v44.13,18.89 | v28.1,8.1 28.1,11.11 25.4,13.81 v25.4,18.89
  Bottom 0.406: v44.13,18.89 v25.4,18.89 | v28.1,8.1 28.1,9.53 R30.2
GATE_1_MC  (via drill 0.3 pad 0.7)
  Top 0.406: v64.93,9.68 65.56,10.32 65.56,33.02 66.83,34.29 69.48,34.29 SIG2.3 | v39.53,9.05 39.53,10.89 IC2.9
  Bottom 0.406: v64.93,9.68 64.45,9.05 43.97,9.05 42.39,7.46 41.12,7.46 v39.53,9.05
GATE_1_PWR
  Bottom 0.406: SIG1.3 83.93,48.37 84.77,49.21 84.77,50.32 85.57,51.12 T2.1
GATE_2_MC  (via drill 0.3 pad 0.7)
  Top 0.406: SIG2.4 69.52,36.35 66.99,36.35 64.45,33.81 64.45,11.27 v63.66,10.48 | v40.64,9.53 40.64,10.16 41.27,10.95 41.27,11.84 IC2.10
  Bottom 0.406: v63.66,10.48 63.18,10 43.66,10 42.07,8.41 41.59,8.41 40.64,9.37 v40.64,9.53
GATE_2_PWR
  Bottom 0.406: SIG1.4 82.09,45.24 T1.1
GND  (via drill 0.3 pad 0.7)
  other vias: 86.52,25.08 85.57,28.26 83.34,19.84 90.01,30.8 89.06,22.54 88.58,24.92 92.71,30.32 85.72,38.1 88.9,38.1 82.23,35.88 37.7,12.7 94.14,25.72 93.03,23.02 75.56,28.26 76.2,34.77 58.74,38.42 55.09,36.83 38.26,37.15 44.13,30.32 40.01,32.7 56.52,28.89 69.69,38.58 63.98,35.72 72.23,36.67 73.03,32.86 75.56,30.64 54.29,20.95 60.01,3.81 61.44,2.06 68.42,18.73 66.52,9.37 70.48,14.13 74.3,17.62 74.77,9.84 87.79,16.83 80.01,8.73 34.13,13.49 33.18,11.11 37.15,6.67 35.24,8.1 85.72,14.13 85.88,11.59 90.96,10 80.01,2.38 77.15,4.92 72.55,4.92 68.26,3.97 63.98,4.6 52.7,3.17 59.05,3.33 40.16,7.3 29.53,27.62 39.21,30.8 47.62,30 72.07,16.67 72.55,11.11 78.74,36.51 94.61,35.72 94.93,31.43 95.89,27.78 96.2,23.65 95.89,19.53 58.9,36.51 48.1,36.67 40.96,15.88 44.93,15.72 42.07,13.81 24.61,25.56 31.51,27.94 26.59,23.81 20,28.1 17.78,32.38 20.32,31.11 22.54,36.51 30.16,36.2 34.13,37.31 31.75,37.78 27.94,35.56 41.27,5.87 38.26,4.13 44.37,36.35 65.41,38.58 72.07,38.58 88.58,20.8 93.03,21.27 62.55,12.62 62.39,17.22 93.5,27.86 49.61,16.67 50.64,20.32 52.55,21.91 60.01,22.38 63.02,22.07 57.47,32.23 33.18,20.32 30.32,9.37 31.43,7.3 31.67,3.1 20.56,4.68 20.08,1.35 16.43,4.05 6.43,4.52 11.99,18.34 73.42,25.8 76.12,25.8 37.94,32.94 28.89,32.78 30.16,30.24 22.54,29.61 25.08,38.5 94.93,1.83 94.46,11.19 75.41,37.23
  pour Top (isolate 0.305): 0,0 100.01,0 100,40 0,40
  pour Bottom (isolate 0.305): 0,0 100,0 100,40 0,40
GNDA  (via drill 0.3 pad 0.7)
  Top 0.406: v87.31,67.31 86.38,67.47 C7.- 86.06,67.47 v85.09,67.31
  Bottom 0.254: 30.48,76.84 X2.2 | 46.81,75.65 U$3.P$2 | 25.24,70.17 25.56,70.48 U1.3 27.15,70.48 27.3,70.64
  Bottom 0.406: U$2.P$2 30.48,76.84 | X3.2 46.81,75.65 | 17.23,74.37 C13.2 17.62,74.3 17.62,73.82 18.1,73.34 U2.2
  other vias: 6.83,70.33 23.02,70.25 32.23,74.61 27.78,77.95 27.78,76.2 11.43,78.11 11.11,74.77 6.67,74.61 16.99,76.04 18.18,68.58 85.41,75.88 87.15,75.88 85.57,73.98 85.57,72.39 85.57,70.96 85.57,69.37 87.31,69.37 87.31,70.96 87.31,72.39 87.31,73.98 90.49,72.39 90.49,70.96 90.49,69.37 71.12,65.25 73.34,65.25 75.72,65.25 71.12,63.34 73.34,63.34 75.72,63.34 71.12,61.44 72.23,64.29 74.61,64.29 86.52,61.28 85.25,60.17 89.06,50.48 83.98,54.13 76.04,53.66 78.26,50.16 76.04,46.2 10.16,64.93 16.03,60.8 10.16,53.34 15.72,49.85 11.27,60.01 15.72,54.61 9.84,48.58 6.83,62.07 6.35,56.36 6.35,50.16 14.45,64.29 9.21,73.66 6.67,77.15 32.38,77.79 32.38,76.04 43.97,76.04 49.21,77.95 49.21,76.2 69.22,74.61 66.04,77.95 71.91,79.38 79.38,78.11 83.19,73.18 83.19,71.12 83.03,75.56 53.82,73.5 92.87,60.33 92.39,58.1 78.9,45.56 76.36,49.05 77.31,52.23 84.77,47.31 87.79,50.16 85.25,44.61 77.15,67.31 73.66,67.47 79.22,67.31 34.92,67.47 30,46.04 30.48,43.18 32.86,42.07 36.2,42.07 39.53,42.07 64.14,43.02 65.88,42.7 85.88,42.86 90.01,42.86 89.38,60.8 18.1,71.28 17.22,66.04 42.86,64.14 44.29,62.55 17.78,57.78 17.78,51.59 90.41,73.98 88.82,73.98 88.82,72.39 88.82,70.96 88.82,69.37
  pour Top (isolate 0.406): 0,81.28 100.01,81.28 100.01,41.27 0,41.27
  pour Bottom (isolate 0.406, rank 6): 0,81.28 100.01,81.28 100.01,41.27 0,41.27
JBC_1_SLEEP  (via drill 0.3 pad 0.7)
  Top 0.406: IC2.12 42.94,6.74 v42.55,6.35
  Bottom 0.406: SLEEP2.1 89.85,7.03 88.31,8.57 R22.1 85.89,8.41 C26.1 84.29,6.82 83.82,6.35 79.85,6.35 78.11,8.1 44.29,8.1 v42.55,6.35
JBC_1_TEMP_ADC  (via drill 0.3 pad 0.7)
  Top 0.406: v44.13,14.45 45.88,14.45 46.42,14.99 IC2.19 50.41,14.99 C19.1 | v30.64,15.4 30.64,24.13 28.26,26.51 v26.99,26.51
  Bottom 0.406: R27.1 R4.1 v26.99,26.51 | v44.13,14.45 43.66,14.92 31.11,14.92 v30.64,15.4
JBC_2_SLEEP  (via drill 0.3 pad 0.7)
  Top 0.406: IC2.13 43.74,6.9 v44.13,6.51
  Bottom 0.406: SLEEP2.2 89.85,4.71 88.31,3.18 R21.1 85.89,3.33 C27.1 84.29,4.76 83.82,5.24 79.38,5.24 77.79,6.83 44.45,6.83 v44.13,6.51
JBC_2_TEMP_ADC  (via drill 0.3 pad 0.7)
  Top 0.406: v45.88,17.14 46.13,17.39 IC2.22 49.3,17.39 50.48,18.57 C20.1 | v33.18,16.67 34.45,17.94 34.45,26.35 v34.13,26.67
  Bottom 0.406: R5.1 R32.1 v34.13,26.67 | v33.18,16.67 33.34,16.83 45.56,16.83 v45.88,17.14
MISO
  Top 0.406: U$5.MISO 45.4,4.13 46.2,4.92 46.2,11.84 IC2.16
MOSI  (via drill 0.3 pad 0.7)
  Top 0.406: v44.93,5.56 45.34,5.97 IC2.15 | v57.78,5.56 57.63,5.71 57.63,21.43 50.91,28.15 OLED2.2
  Bottom 0.406: U$5.MOSI 42.86,5.08 43.34,5.56 v44.93,5.56 v57.78,5.56
N$1  (via drill 0.3 pad 0.7)
  Top 0.406: R1.2 32.86,54.93 31.59,53.66 31.59,44.61 32.54,43.66 41.43,43.66 v42.07,43.02 | IC5.4 60.17,45.09 v61.28,43.97
  Bottom 0.406: v42.07,43.02 42.39,42.7 60.01,42.7 v61.28,43.97
N$2
  Top 0.406: Q2.1 38.18,66.12 37.31,66.04 31.75,66.04 30.96,65.25 30.96,58.74 31.67,58.02 Q1.1 35.4,57.86 R1.1
N$3
  Bottom 0.406: LED1.2 90.6,52.82 R3.1
N$4
  Top 0.406: IC5.2 67.94,49.05 67.94,53.82 69.06,54.93 88.31,54.93 LED1.1
  Bottom 0.406: T2.3 83.5,50.64 85.09,52.23 85.09,53.5 86.52,54.93 88.31,54.93 LED1.1
N$5  (via drill 0.3 pad 0.7)
  Top 0.406: v66.67,43.81 66.52,43.97 IC5.1
  Bottom 0.406: R2.1 66.99,43.5 v66.67,43.81
N$6
  Top 0.406: X4.1 37.86,14.19 IC2.7
N$7
  Top 0.406: R14.1 39.05,53.9 Q4.1 37.7,53.02 33.34,53.02 32.7,52.39 32.7,47.78 33.97,46.51 34.85,46.51 Q3.1 | 35.8,45.56 Q3.1 | 35.64,45.88 Q3.1
N$8  (via drill 0.3 pad 0.7)
  Top 0.406: Q2.2 v51.91,63.58
  Bottom 3.81: X2.3 35.54,72.09 39.53,68.1 45.4,68.1 48.1,65.72
  other vias: 47.31,68.42 49.53,68.42 51.91,68.42 54.45,68.42 49.53,66.04 51.91,66.04 54.45,66.04 47.31,66.04 49.53,63.58 54.45,63.66 47.31,61.04 47.31,58.82 49.53,58.82 51.91,58.82 54.45,58.82 49.53,61.04 51.91,61.04 54.45,61.04 47.31,63.5
  pour Bottom: 55.24,69.22 46.35,69.22 46.35,58.1 55.24,58.1
N$9  (via drill 0.3 pad 0.7)
  Top 0.406: 73.66,61.28 OK1.1 73.03,61.28 v70.96,59.21
  Bottom 0.406: R10.2 70.49,59.21 v70.96,59.21
N$10  (via drill 0.3 pad 0.7)
  Top 0.254: Q4.2 48.74,53.42 47.47,56.2 v47.31,56.2
  Top 3.81: 53.58,51.36 Q4.2
  Bottom 2.184: 57.31,74.77 56.91,75.17 56.52,75.56 | X3.3 53.16,76.86 53.18,76.83
  Bottom 3.81: 53.18,76.83 55.24,76.83 56.91,75.17 | 57.31,74.77 58.9,73.18 58.9,53.26 56.99,51.36 v51.91,51.36
  other vias: 49.53,56.2 51.91,56.2 54.45,56.2 49.53,53.82 51.91,53.82 54.45,53.82 47.31,53.82 47.31,51.36 49.53,51.36 54.45,51.44 47.31,48.82 47.31,46.59 49.53,46.59 51.91,46.59 54.45,46.59 49.53,48.82 51.91,48.82 54.45,48.82
  pour Bottom: 55.24,56.83 46.35,56.83 46.35,45.72 55.24,45.72
N$11
  Bottom 0.406: R18.1 24.29,75.77 24.34,75.83 | 24.34,75.83 X2.1 | R9.2 22.86,77.31 24.34,75.83
N$12  (via drill 0.3 pad 0.7)
  Top 0.813: v75.25,79.38 76.99,79.38 77.15,79.22 C3.+ | D1.C 66.88,67.52 v68.26,68.9
  Bottom 0.813: v75.25,79.38 70.65,74.78 F4.2 69.06,69.69 v68.26,68.9
N$13
  Bottom 0.254: 41.73,74.27 R17.1
  Bottom 0.406: X3.1 41.73,74.27 | R8.2 41.52,74.06 R17.1
N$14
  Top 0.406: Q2.3 40.64,61.04 | 40.64,61.04 42.31,61.04 43.97,59.37 43.97,46.04 45.4,44.61 55.56,44.61 58.58,47.62 IC5.3 | 40.95,60.72 40.64,61.04
  Top 1.93: Q1.3 Q2.3
N$15
  Top 0.406: 39.37,48.26 Q4.3 39.45,48.9 40.01,48.9 40.64,48.26 40.64,46.52 44.45,42.7 61.91,42.7 63.02,43.81 63.02,52.23 61.59,53.66 IC4.3
  Top 1.93: Q3.3 Q4.3
N$16  (via drill 0.3 pad 0.7)
  Top 0.406: R14.2 41.91,56.36 43.02,55.24 43.02,45.56 44.93,43.66 56.04,43.66 v58.42,46.04 | v60.01,50.01 60.01,51.11 IC4.4
  Bottom 0.406: v58.42,46.04 58.42,48.42 v60.01,50.01
N$17
  Top 0.406: LED2.1 88.47,48.26 89.53,48.26 90.65,49.37 90.65,56.04 90.01,56.67 87.15,56.67 86.36,55.88 68.74,55.88 IC4.2
  Bottom 0.406: T1.3 86.04,46.67 87.63,48.26 88.38,48.26 LED2.1
N$18  (via drill 0.3 pad 0.7)
  Top 0.406: v66.52,50.16 IC4.1
  Bottom 0.406: R15.1 67.95,51.6 v66.52,50.16
N$19
  Top 0.406: X4.3 39.05,12.55 IC2.8
N$20
  Bottom 0.406: LED2.2 88.53,46.2 R16.1
N$21
  Top 3.81: F3.1 14.11,71.56 X1.2
N$23
  Bottom 0.406: D6.C 63.3,51.91 R10.1
N$24  (via drill 0.3 pad 0.7)
  Top 0.406: v70.8,18.1 C18.2
  Bottom 0.406: JP2.2 v70.8,18.1
N$25  (via drill 0.3 pad 0.7)
  Top 0.406: C18.1 77.79,19.37 v79.85,21.43
  Bottom 0.406: v79.85,21.43 80.09,21.67 IC3.2
N$26
  Bottom 0.406: IC1.2 84.39,64.77 F1.2
N$27
  Bottom 0.406: IC3.1 82.87,21.02 81.54,19.68 75.56,19.68 74.93,20.32 R24.2
N$28
  Bottom 0.406: IC3.5 77.43,23.62 R23.2
N$29
  Bottom 0.406: IC3.23 93.84,24.27 94.46,23.65 94.46,19.84 93.03,18.41 R25.1
N$30  (via drill 0.3 pad 0.7)
  Top 0.406: v92.55,25.08 90.17,22.7 90.17,20.16 v88.58,18.57
  Bottom 0.406: v92.55,25.08 92.39,24.92 IC3.22 | R26.1 88.74,18.41 v88.58,18.57
N$31
  Bottom 0.406: RX.C R25.2
N$32  (via drill 0.3 pad 0.7)
  Top 0.406: F2.1 85.08,30.49 v85.57,30
  Bottom 0.406: v85.57,30 85.71,30.15 USB.VBUS
N$33
  Bottom 0.406: TX.C R26.2
N$35
  Bottom 0.406: R27.2 24.97,29.73 TEMP1.2
N$37
  Bottom 0.406: R28.1 R31.2 56.99,15.56 61.12,15.56 SG2.-
N$38
  Bottom 0.406: DBG1.A R11.1
N$39
  Bottom 0.813: F4.1 76.92,69.69 LM2940SX-12.1
N$40
  Bottom 0.406: DBG2.A R19.1
N$41
  Bottom 0.406: DBG3.A R29.1
N$42
  Bottom 0.406: DBG4.A R30.1
N$46
  Bottom 0.406: T3.3 54.45,15.55 R31.1
N$47
  Bottom 0.406: R32.2 34.18,29.73 TEMP2.2
OLED_CS  (via drill 0.3 pad 0.7)
  Top 0.406: IC2.2 38.16,18.19 36.99,19.37 36.99,28.1 v38.26,29.37 | v53.02,29.53 53.02,31.96 OLED2.3
  Bottom 0.406: v53.02,29.53 52.39,28.89 38.73,28.89 v38.26,29.37
OLED_DC  (via drill 0.3 pad 0.7)
  Top 0.406: OLED2.4 54.91,25.73 58.9,21.75 v58.9,12.06 | v41.75,9.84 42.14,10.23 IC2.11
  Bottom 0.406: v58.9,12.06 57.78,10.95 42.86,10.95 v41.75,9.84
RESET  (via drill 0.3 pad 0.7)
  Top 0.406: U$5.RST 40.32,4.45 39.85,4.92 35.24,4.92 33.42,6.75 | 33.42,6.75 31.91,8.26 31.91,25.08 v31.75,25.24 | v41.27,26.04 42.94,24.37 42.94,22.94 IC2.29 | RESET.P$4 RESET.P$3 | JP1.2 29.53,2.86 33.42,6.75 | v69.85,27.94 67.79,25.88 v67.79,22.23 66.99,21.43 v66.99,12.86 | v78.9,26.99 R20.1
  Bottom 0.406: 70.25,26.91 68.74,25.4 41.91,25.4 v41.27,26.04 41.12,26.19 37.62,26.19 36.67,25.24 v31.75,25.24 | 70.25,26.91 70.33,26.99 v78.9,26.99 | JP2.3 68.1,21.91 v67.79,22.23 | v69.85,27.94 70.25,27.54 70.25,26.91 | v66.99,12.86 74.51,12.86 RESET.P$3
RX  (via drill 0.3 pad 0.7)
  Top 0.406: IC2.30 42.14,23.58 v40.48,25.24 | v75.88,24.61 75.88,22.38 v77.15,21.11
  Bottom 0.406: R24.1 v77.15,21.11 | v75.88,24.61 41.12,24.61 v40.48,25.24
SCK  (via drill 0.3 pad 0.7)
  Top 0.406: U$5.SCK 42.86,3.65 43.5,4.29 v44.13,4.29 | v47.47,3.65 47.47,13.23 IC2.17 | OLED2.1 48.91,28.56 55.72,21.75 v55.72,3.65
  Bottom 0.406: v44.13,4.29 44.45,4.6 46.35,4.6 v47.47,3.65 48.26,4.45 54.93,4.45 v55.72,3.65
SCL_MC  (via drill 0.3 pad 0.7)
  Top 0.406: IC2.28 43.74,27.7 v43.81,27.86
  Bottom 0.406: I2C2.2 61.8,32.38 62.55,32.38 63.34,31.59 63.34,29.69 61.52,27.86 v43.81,27.86
SCL_PWR
  Bottom 0.254: 30.48,69.44 U1.10
  Bottom 0.406: 30.64,68.42 30.64,68.9 30.64,69.28 30.48,69.44 | 30.64,68.42 30.48,68.26 25.4,68.26 24.77,68.9 19.37,68.9 19.04,69.23 U2.4 | I2C1.2 72.03,50.37 R7.1 70.96,50.96 67.15,47.15 60.96,47.15 58.42,44.61 45.4,44.61 44.77,45.24 34.92,45.24 31.91,48.26 31.91,67.14 30.64,68.42
SDA_MC  (via drill 0.3 pad 0.7)
  Top 0.406: IC2.27 44.54,26.6 45.24,27.3 45.24,29.37 46.35,30.48 46.35,34.77 v46.83,35.24
  Bottom 0.406: v46.83,35.24 60.85,35.24 I2C2.3
SDA_PWR  (via drill 0.3 pad 0.7)
  Top 0.406: v33.02,67.47 30.48,67.47 v30,66.99
  Bottom 0.254: 31.91,69.69 31.61,69.98 U1.9
  Bottom 0.406: v33.02,67.47 31.91,68.58 31.91,69.69 | I2C1.3 71.87,48.37 R6.1 70.01,47.94 67.94,45.88 61.44,45.88 59.21,43.66 44.93,43.66 44.29,44.29 34.45,44.29 30.48,48.26 30.48,66.52 v30,66.99 29.53,67.47 24.92,67.47 24.45,67.94 19.37,67.94 18.89,67.47 17.62,67.47 17.16,67.93 U2.6
TC_1_N  (via drill 0.3 pad 0.7)
  Top 0.406: v22.07,73.66 22.23,73.82 v30.48,73.82
  Bottom 0.254: C5.2 | C5.2 | 21.92,73.51 v22.07,73.66 | v30.48,73.82 30.16,73.82 C5.2
  Bottom 0.305: C5.2 30.48,73.03 30.16,72.71 27.53,72.71 U1.5
  Bottom 0.406: U$2.P$1 C5.2 | D9.1 D9.2 21.77,73.51 21.92,73.51 | R9.1 22.23,73.82 v22.07,73.66
TC_1_P
  Bottom 0.254: U1.4 25.22,70.98 | R18.2
  Bottom 0.406: R18.2 C5.1 | R18.2 26.19,73.18 25.08,72.07 25.08,70.98 | 25.22,70.98 25.08,70.98 | 25.08,70.98 24.09,70.98 D9.3
TC_2_N  (via drill 0.3 pad 0.7)
  Top 0.406: C4.2 46.67,73.18 44.45,73.18 42.7,71.44 32.86,71.44 v32.38,70.96
  Bottom 0.254: 47.62,74.71 C4.2 | U1.7 32.41,70.98 v32.38,70.96
  Bottom 0.406: 47.62,74.71 U$3.P$1 46.83,75.41 45.88,75.41 45.24,76.04 45.24,77.31 43.97,78.58 40.64,78.58 39.37,77.31 R8.1 | C4.2 47.47,74.3 C4.2 49.05,74.14 D8.1 D8.2
  other vias: 47.62,74.14
TC_2_P  (via drill 0.3 pad 0.7)
  Top 0.406: v32.07,72.55 v42.23,72.55
  Bottom 0.254: U1.6 31,71.48 v32.07,72.55
  Bottom 0.406: R17.2 C4.1 45.72,73.34 47.62,71.44 50.49,71.44 D8.3 | 43.18,73.82 R17.2 | v42.23,72.55 42.55,72.55 43.5,73.5 R17.2
TX  (via drill 0.3 pad 0.7)
  Top 0.406: IC2.31 41.34,22.8 v40.32,23.81
  Bottom 0.406: v40.32,23.81 74.14,23.81 R23.1
USB+
  Bottom 0.406: IC3.15 88.48,29.47 87.31,30.64 USB.D+
USB-
  Bottom 0.406: IC3.16 87.71,28.82 86.52,30 USB.D-
V+
  Top 0.406: D2.A 80.4,29.14 C22.1 80.33,30.32 78.9,31.75 C21.1 82.24,31.78 F2.2 81.63,31.46
ZC_MC  (via drill 0.3 pad 0.7)
  Top 0.406: IC2.32 39.68,20.48 39.21,20.95 39.21,25.4 41.75,27.94 v42.23,27.94
  Bottom 0.406: SIG2.2 69.48,32.38 68.26,32.38 62.87,26.99 43.18,26.99 v42.23,27.94
ZC_PWR  (via drill 0.3 pad 0.7)
  Top 0.406: OK1.4 84.45,61.28 85.88,62.71 v86.2,62.71
  Bottom 0.406: SIG1.2 81.8,50.37 82.71,51.28 82.71,60.96 84.45,62.71 v86.2,62.71 89.22,62.71 R12.2

### Text on the board
tPlace: VCC | JBC1 | JBC2 | FUSE | LED1 | AK | LED2 | AK | I2C | SIG | T1 | T2 | SPI_OLED | I2C | SIG | SLEEP1 | debugWIRE | SLEEP2 | ISP | SLEEP | GND | 1
bPlace: NTC | FUSE | FUSE | SOLDERING / STATION / 10.2018 V2 | USB | | | | | dW | DBG1 | DBG2 | TX | RX | DBG3 | RST | DBG4 | SLEEP1 | debugWIRE | SLEEP | SLEEP2 | ISP | GND